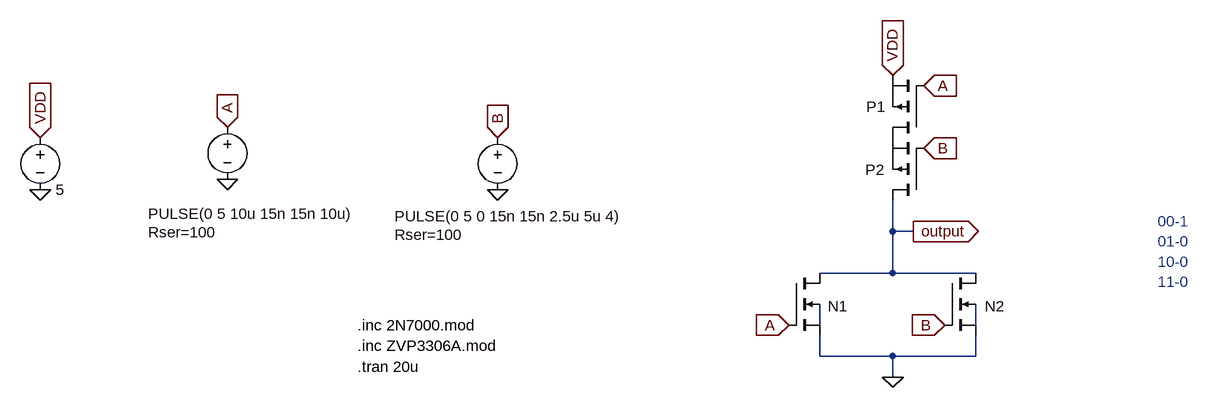
[diagram p0: schematic NOR.asc]
NOR.asc, the LTspice schematic file:
Version 4.1
SHEET 1 1280 680
WIRE 816 144 816 96
WIRE 848 144 816 144
WIRE 816 208 816 144
WIRE 816 208 704 208
WIRE 944 208 816 208
WIRE 704 288 704 256
WIRE 944 288 944 256
WIRE 704 336 704 304
WIRE 816 336 704 336
WIRE 944 336 944 304
WIRE 944 336 816 336
WIRE 816 368 816 336
FLAG -496 0 VDD
IOPIN -496 0 In
FLAG -496 80 0
FLAG -208 -16 A
IOPIN -208 -16 In
FLAG 208 0 B
IOPIN 208 0 In
FLAG -208 64 0
FLAG 208 80 0
FLAG 816 368 0
FLAG 816 -96 VDD
IOPIN 816 -96 In
FLAG 848 144 output
IOPIN 848 144 Out
FLAG 864 -80 A
IOPIN 864 -80 In
FLAG 656 288 A
IOPIN 656 288 In
FLAG 864 16 B
IOPIN 864 16 In
FLAG 896 288 B
IOPIN 896 288 In
SYMBOL nmos4 656 208 R0
WINDOW 0 60 51 Left 2
WINDOW 3 56 72 Invisible 2
SYMATTR InstName N1
SYMATTR Value 2N7000
SYMATTR Prefix X
SYMBOL pmos 864 0 R180
WINDOW 0 59 48 Left 2
WINDOW 3 56 72 Invisible 2
SYMATTR InstName P1
SYMATTR Value ZVP3306A
SYMATTR Prefix X
SYMBOL voltage -496 -16 R0
WINDOW 0 24 16 Invisible 2
WINDOW 123 0 0 Left 0
WINDOW 39 0 0 Left 0
SYMATTR InstName VDD
SYMATTR Value 5
SYMBOL voltage -208 -32 R0
WINDOW 0 24 16 Invisible 2
WINDOW 3 -122 149 Left 2
WINDOW 123 0 0 Left 0
WINDOW 39 -122 177 Left 2
SYMATTR InstName A
SYMATTR Value PULSE(0 5 10u 15n 15n 10u)
SYMATTR SpiceLine Rser=100
SYMBOL voltage 208 -16 R0
WINDOW 0 24 16 Invisible 2
WINDOW 3 -159 137 Left 2
WINDOW 123 0 0 Left 0
WINDOW 39 -159 165 Left 2
SYMATTR InstName B
SYMATTR Value PULSE(0 5 0 15n 15n 2.5u 5u 4)
SYMATTR SpiceLine Rser=100
SYMBOL nmos4 896 208 R0
WINDOW 0 62 51 Left 2
WINDOW 3 56 72 Invisible 2
SYMATTR InstName N2
SYMATTR Value 2N7000
SYMATTR Prefix X
SYMBOL pmos 864 96 R180
WINDOW 0 61 47 Left 2
WINDOW 3 56 72 Invisible 2
SYMATTR InstName P2
SYMATTR Value ZVP3306A
SYMATTR Prefix X
TEXT -8 288 Left 2 !.inc 2N7000.mod
TEXT -8 320 Left 2 !.inc ZVP3306A.mod
TEXT -8 352 Left 2 !.tran 20u
TEXT 1224 128 Left 2 ;00-1\n01-0\n10-0\n11-0

The netlist it stands for:
* NOR.asc
X§N1 output A 0 N001 2N7000  ; pins D G S B
X§P1 P001 A VDD ZVP3306A  ; pins D G S
VDD VDD 0 5
V§A A 0 PULSE(0 5 10u 15n 15n 10u) Rser=100
V§B B 0 PULSE(0 5 0 15n 15n 2.5u 5u 4) Rser=100
X§N2 output B 0 N002 2N7000  ; pins D G S B
X§P2 output B P001 ZVP3306A  ; pins D G S
.inc 2N7000.mod
.inc ZVP3306A.mod
.tran 20u
* 00-1
* 01-0
* 10-0
* 11-0
.backanno
.end